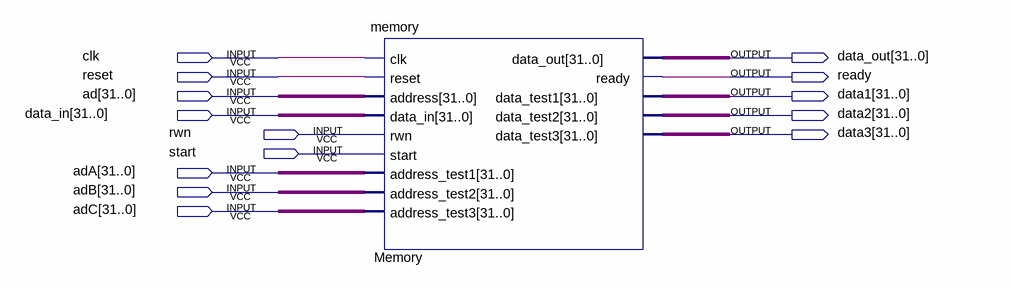
[diagram p0: schematic sheet]
// Quartus schematic HW3.bdf as structural Verilog: 1 symbols, 14 pins
module HW3 (
  input  clk,
  input  reset,
  input  [31:0] ad,
  input  [31:0] data_in,
  input  rwn,
  input  start,
  input  [31:0] adA,
  input  [31:0] adB,
  input  [31:0] adC,
  output [31:0] data_out,
  output ready,
  output [31:0] data1,
  output [31:0] data2,
  output [31:0] data3
);

  memory Memory (
    .clk(clk), .reset(reset), .address(ad), .data_in(data_in), .rwn(rwn), .start(start), .address_test1(adA),
    .address_test2(adB), .address_test3(adC), .data_out(data_out), .ready(ready), .data_test1(data1),
    .data_test2(data2), .data_test3(data3));
endmodule
